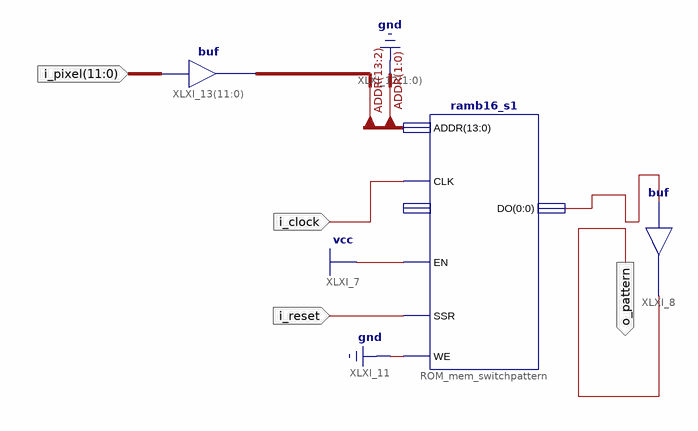
[diagram p0: schematic sheet 1]
// Xilinx ISE schematic mem_switchpattern.sch (spartan3e) as structural Verilog: 3 symbols, 4 ports
module mem_switchpattern (
  input  i_reset,
  input  i_clock,
  input  [11:0] i_pixel,
  output o_pattern
);

  wire \do ;
  wire [13:2] ADDR;

  buf XLXI_8 (o_pattern, \do );
  ramb16_s1 #(.INIT_0B("0101010101010101010101010101010110101010101010101010101010101010"), .INIT_0A("0101010101010101010101010101010110101010101010101010101010101010"), .INIT_09("0101010101010101010101010101010110101010101010101010101010101010"), .INIT_08("0101010101010101010101010101010110101010101010101010101010101010"), .INIT_07("0101010101010101010101010101010110101010101010101010101010101010"), .INIT_06("0101010101010101010101010101010110101010101010101010101010101010"), .INIT_05("0101010101010101010101010101010110101010101010101010101010101010"), .INIT_04("0101010101010101010101010101010110101010101010101010101010101010"), .INIT_03("0101010101010101010101010101010110101010101010101010101010101010"), .INIT_02("0101010101010101010101010101010110101010101010101010101010101010"), .INIT_01("0101010101010101010101010101010110101010101010101010101010101010"), .INIT_00("0101010101010101010101010101010110101010101010101010101010101010")) ROM_mem_switchpattern (
    .ADDR({ADDR, 2'b00}), .CLK(i_clock), .EN(1'b1), .SSR(i_reset), .WE(1'b0), .DO(\do ));  // open: DI
  assign ADDR = i_pixel;  // buf XLXI_13[11..0], 12 bits wide
endmodule
